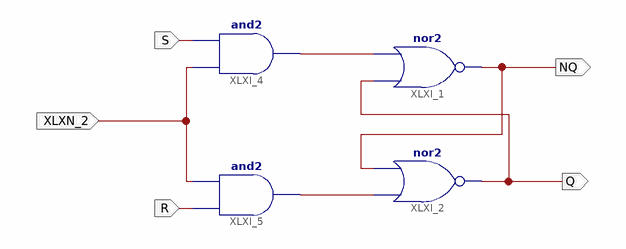
[diagram p0: schematic sheet 1]
// Xilinx ISE schematic latch_RS_NOR.sch (artix7) as structural Verilog: 4 symbols, 5 ports
module latch_RS_NOR (
  input  XLXN_2,
  input  S,
  input  R,
  output Q,
  output NQ
);

  wire in_R, XLXN_1;

  nor XLXI_1 (NQ, Q, XLXN_1);
  nor XLXI_2 (Q, in_R, NQ);
  and XLXI_5 (in_R, R, XLXN_2);
  and XLXI_4 (XLXN_1, XLXN_2, S);
endmodule
